# Altium schematic sheet ankle_sch.SchDoc
size A; SheetNumber: 2; SheetTotal: 2
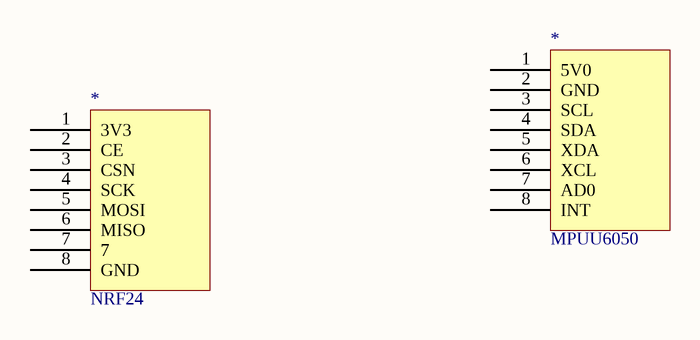
[diagram p0: ankle_sch.SchDoc]

## Parts
(Parts that share a designator on the sheet are numbered #1, #2 ... from top to bottom, then left to right.)
*#1  MPUU6050  [mpu6050]
*#2  NRF24  [nrf24]

## Nets

Not connected (* = marked no-connect by the designer): *#1 1(5V0) 2(GND) 3(SCL) 4(SDA) 5(XDA) 6(XCL) 7(AD0) 8(INT); *#2 1(3V3) 2(CE) 3(CSN) 4(SCK) 5(MOSI) 6(MISO) 7 8(GND)